# Altium schematic sheet Raspberry Pi inputs.SchDoc
size A4; SheetNumber: 1; SheetTotal: 3
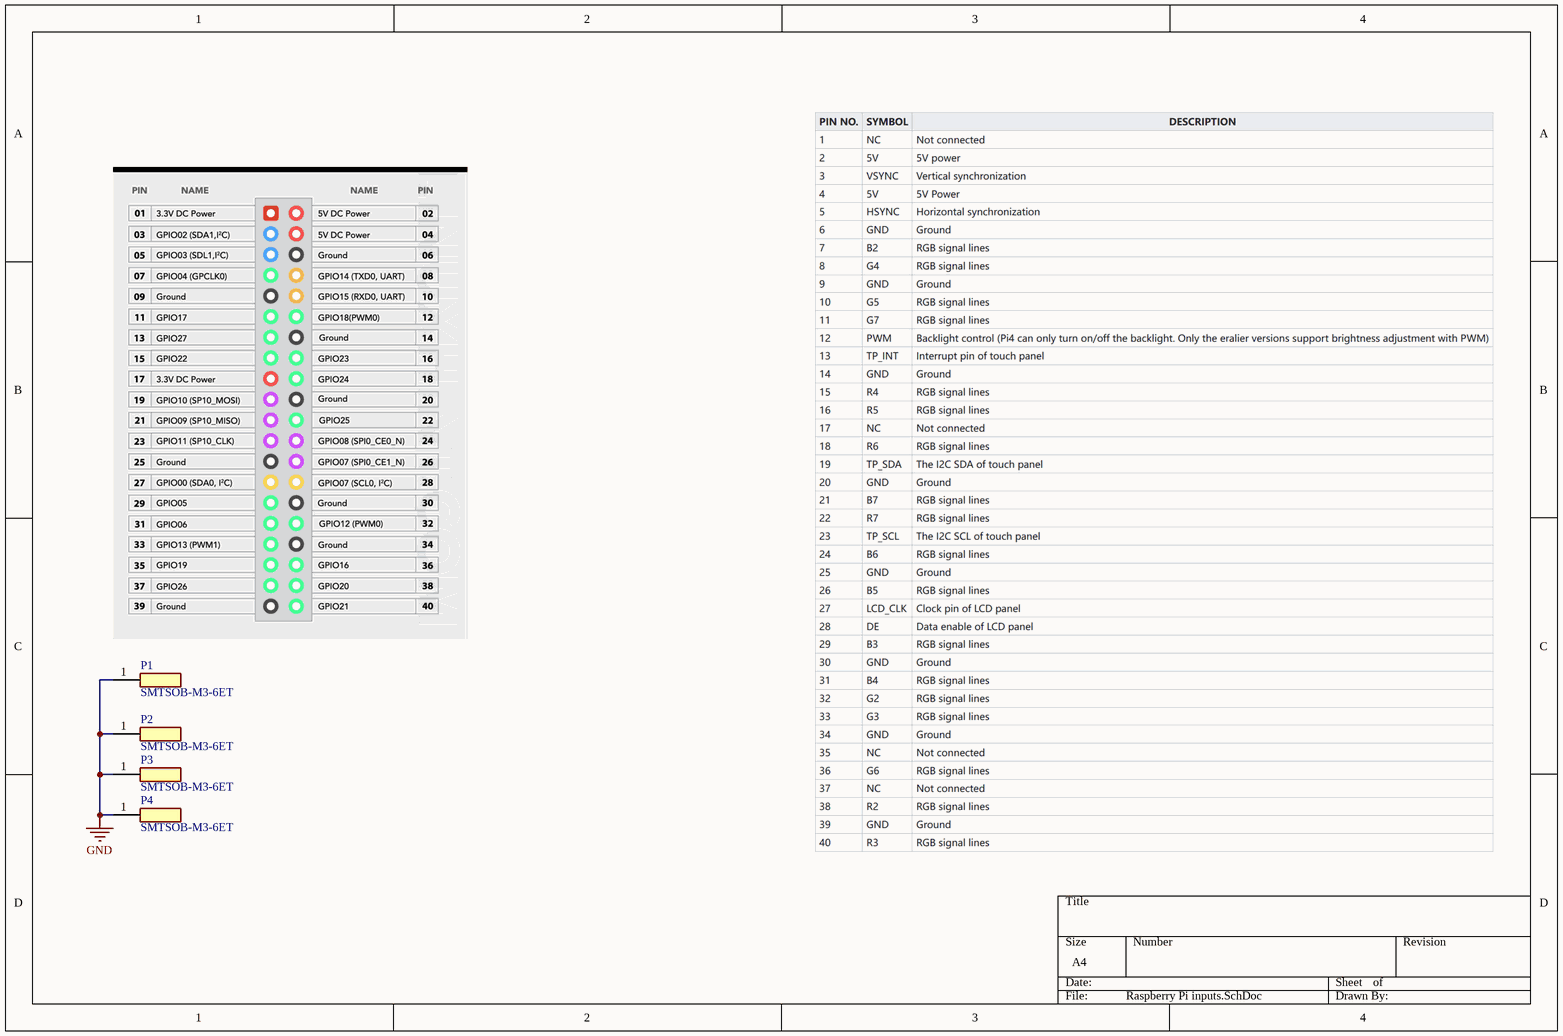
[diagram p0: Raspberry Pi inputs.SchDoc]

## Parts
P1  SMTSOB-M3-6ET  [SMTSOB-M3-6ET]
P2  SMTSOB-M3-6ET  [SMTSOB-M3-6ET]
P3  SMTSOB-M3-6ET  [SMTSOB-M3-6ET]
P4  SMTSOB-M3-6ET  [SMTSOB-M3-6ET]

## Nets
GND: P1.1 P2.1 P3.1 P4.1

## Library data of the parts
P1-P4 = SMTSOB-M3-6ET: Spacer 8mm